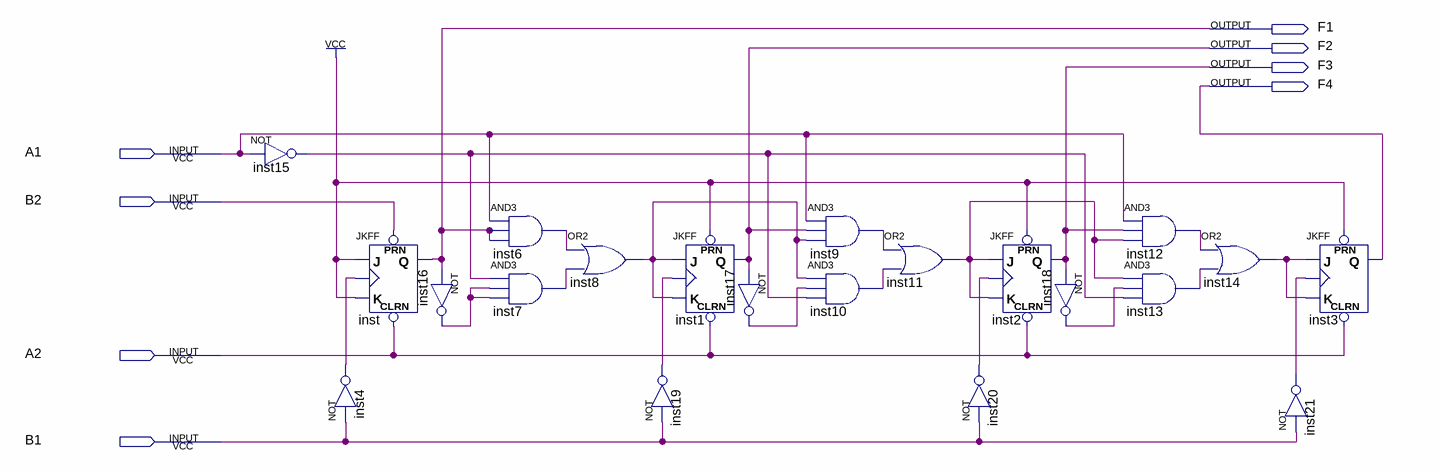
[diagram p0: schematic sheet]
// Quartus schematic AsynBinUp.bdf as structural Verilog: 21 symbols, 8 pins
module AsynBinUp (
  input  A1,
  input  B2,
  input  A2,
  input  B1,
  output F1,
  output F2,
  output F3,
  output F4
);

  wire inst4_out, inst6_out, inst7_out, inst8_out, inst9_out, inst10_out, inst11_out, inst12_out, inst13_out,
       inst14_out, inst15_out, inst16_out, inst17_out, inst18_out, inst19_out, inst20_out, inst21_out;

  not inst15 (inst15_out, A1);
  JKFF inst (.PRN(B2), .CLRN(A2), .K(1'b1), .J(1'b1), .CLK(inst4_out), .Q(F1));
  not inst4 (inst4_out, B1);
  not inst16 (inst16_out, F1);
  and inst6 (inst6_out, A1, F1, F1);
  and inst7 (inst7_out, inst15_out, inst16_out, inst16_out);
  or inst8 (inst8_out, inst6_out, inst7_out);
  not inst19 (inst19_out, B1);
  JKFF inst1 (.PRN(1'b1), .CLRN(A2), .K(inst8_out), .J(inst8_out), .CLK(inst19_out), .Q(F2));
  not inst17 (inst17_out, F2);
  and inst9 (inst9_out, A1, F2, inst8_out);
  and inst10 (inst10_out, inst8_out, inst17_out, inst15_out);
  or inst11 (inst11_out, inst9_out, inst10_out);
  not inst20 (inst20_out, B1);
  JKFF inst2 (.PRN(1'b1), .CLRN(A2), .K(inst11_out), .J(inst11_out), .CLK(inst20_out), .Q(F3));
  not inst18 (inst18_out, F3);
  and inst12 (inst12_out, A1, F3, inst11_out);
  and inst13 (inst13_out, inst11_out, inst18_out, inst15_out);
  or inst14 (inst14_out, inst12_out, inst13_out);
  not inst21 (inst21_out, B1);
  JKFF inst3 (.PRN(1'b1), .CLRN(A2), .K(inst14_out), .J(inst14_out), .CLK(inst21_out), .Q(F4));
endmodule
